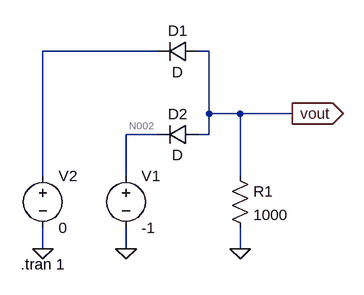
[diagram p0: schematic 1b.asc]
1b.asc, the LTspice schematic file:
Version 4
SHEET 1 880 680
WIRE -80 -32 -256 -32
WIRE 0 -32 -16 -32
WIRE 0 64 0 -32
WIRE 48 64 0 64
WIRE 128 64 48 64
WIRE -80 96 -128 96
WIRE 0 96 0 64
WIRE 0 96 -16 96
WIRE -256 160 -256 -32
WIRE -128 160 -128 96
WIRE 48 160 48 64
WIRE -256 272 -256 240
WIRE -128 272 -128 240
WIRE 48 272 48 240
FLAG 48 272 0
FLAG -128 272 0
FLAG -256 272 0
FLAG 128 64 vout
IOPIN 128 64 Out
SYMBOL res 32 144 R0
SYMATTR InstName R1
SYMATTR Value 1000
SYMBOL voltage -128 144 R0
WINDOW 123 0 0 Left 0
WINDOW 39 0 0 Left 0
SYMATTR InstName V1
SYMATTR Value -1
SYMBOL voltage -256 144 R0
WINDOW 123 0 0 Left 0
WINDOW 39 0 0 Left 0
SYMATTR InstName V2
SYMATTR Value 0
SYMBOL diode -16 -48 R90
WINDOW 0 0 32 VBottom 2
WINDOW 3 32 32 VTop 2
SYMATTR InstName D1
SYMBOL diode -16 80 R90
WINDOW 0 0 32 VBottom 2
WINDOW 3 32 32 VTop 2
SYMATTR InstName D2
TEXT -290 296 Left 2 !.tran 1

The netlist it stands for:
* 1b.asc
R1 vout 0 1000
V1 N002 0 -1
V2 N001 0 0
D1 vout N001 D
D2 vout N002 D
.model D D
.lib standard.dio
.tran 1
.backanno
.end

* Results of the author's LTspice run, read from the files saved beside the schematic
* Operating Point, zero values left out:
*   V(vout) = -370.6 mV
*   V(n002) = -1 V
*   I(D2) = 370.6 µA
*   I(R1) = -370.6 µA
*   I(V1) = 370.6 µA